# EAGLE schematic W1209_PIC (EAGLE 7.7.0)
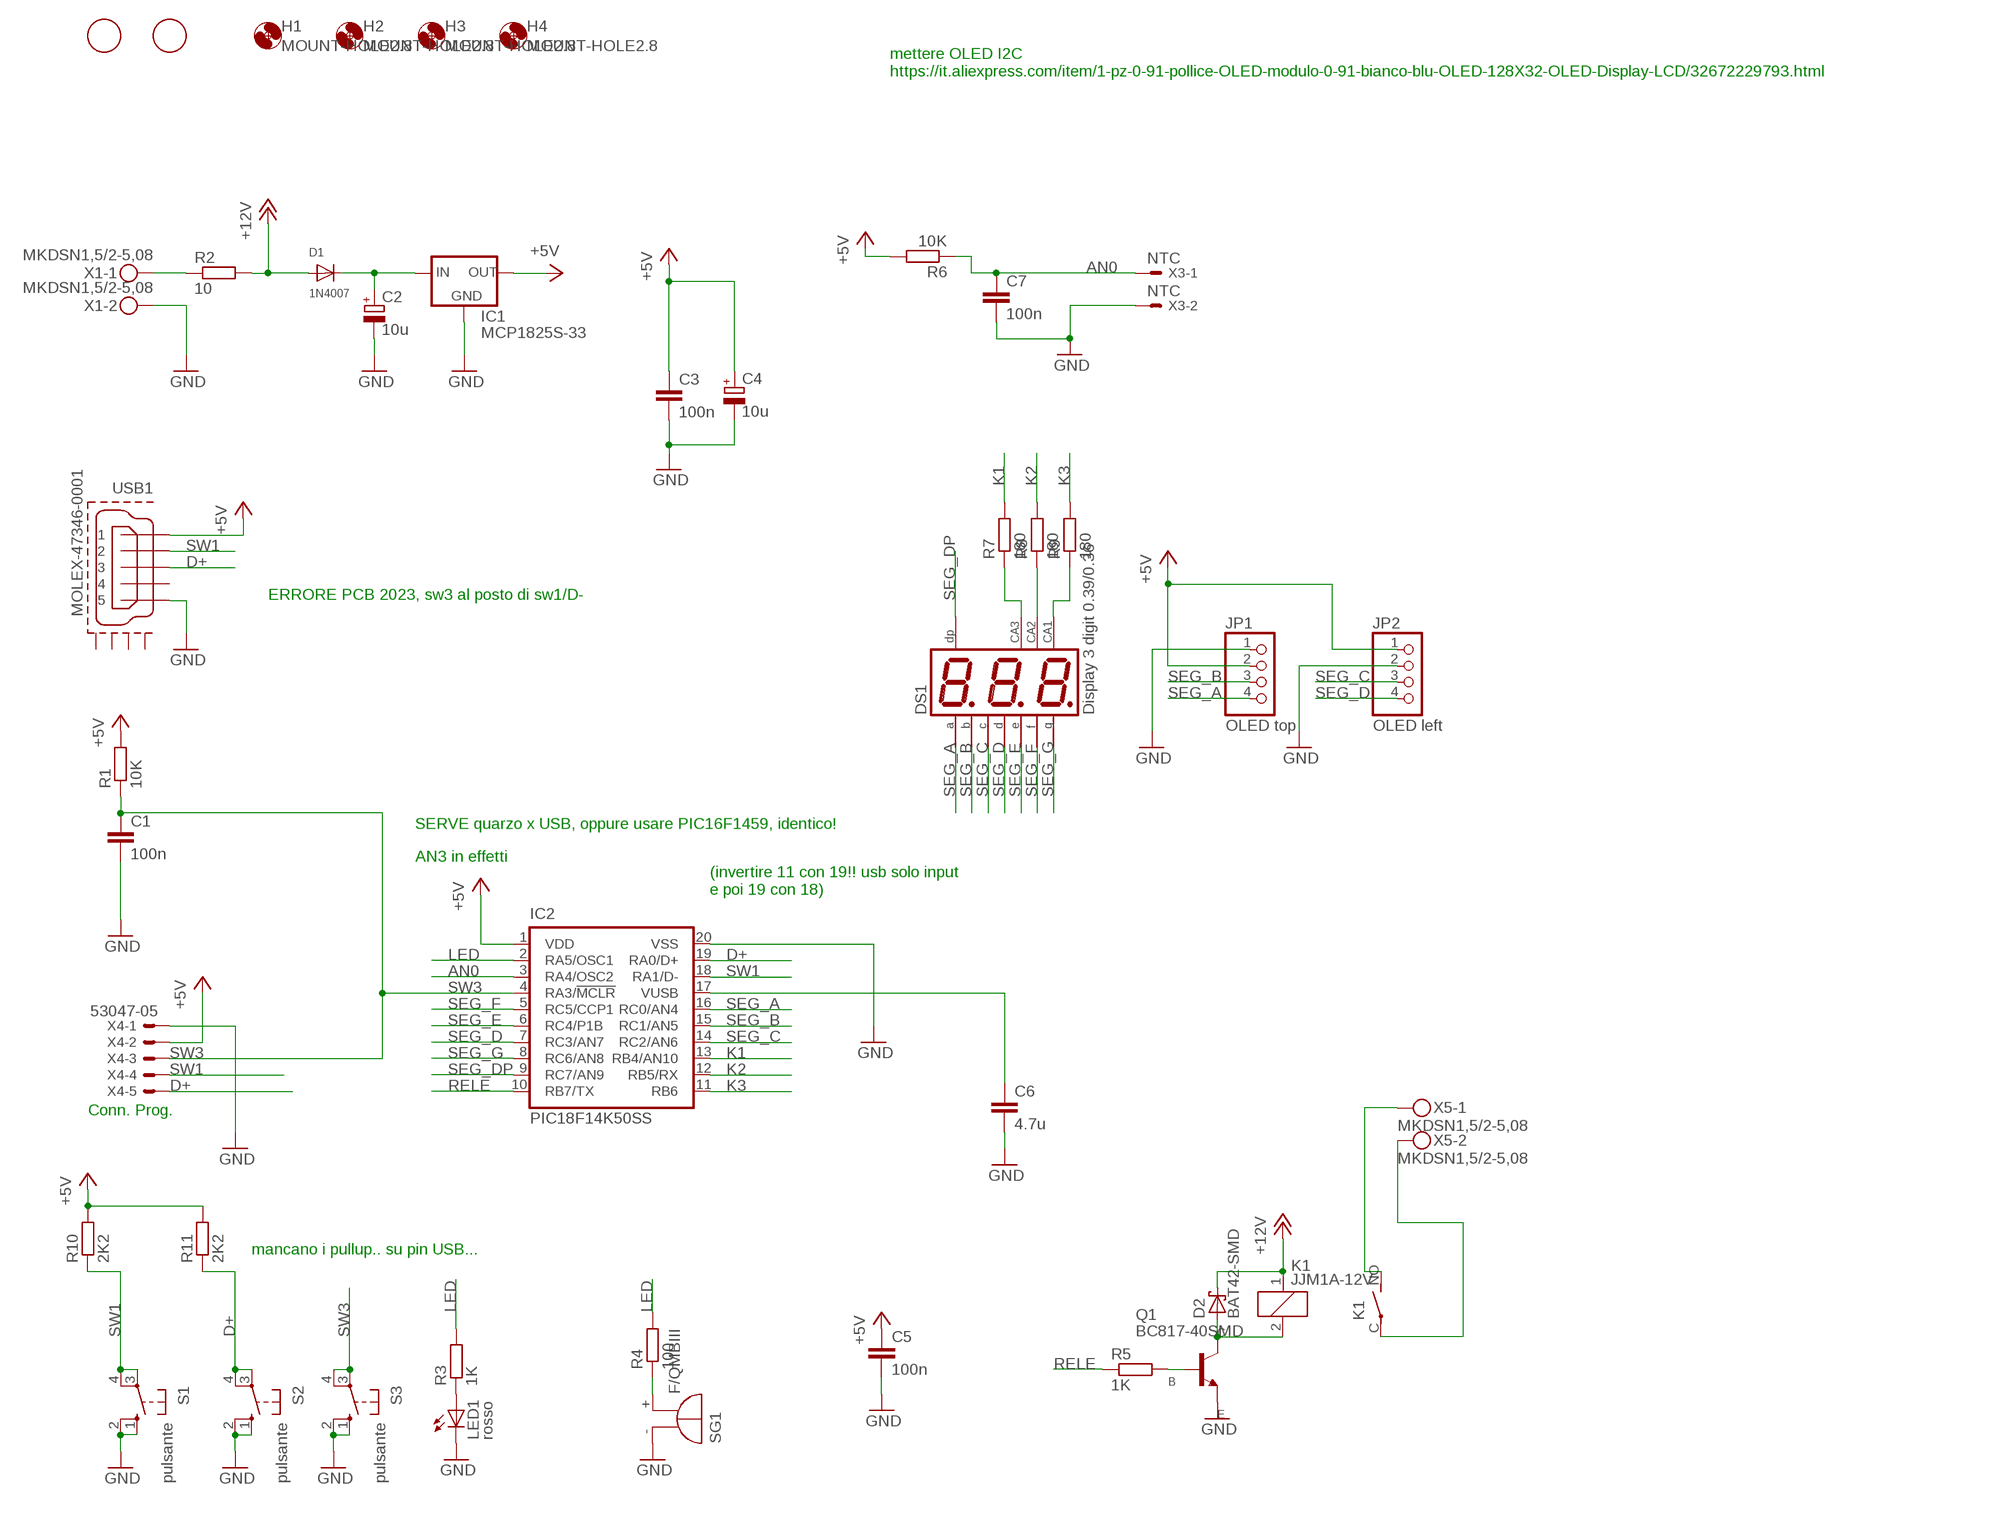
[diagram p0: schematic, sheet 1]

## Parts
C1  100n  C-EUC0805  [C0805]
C2  10u  CPOL-EUSMCC  [SMC_C]
C3  100n  C-EUC0805  [C0805]
C4  10u  CPOL-EUSMCB  [SMC_B]
C5  100n  C-EUC0805  [C0805]
C6  4.7u  C-EUC1206  [C1206]
C7  100n  C-EUC0805  [C0805]
D1  1N4007  DIODESMA  [SMADIODE]
D2  BAT42-SMD  [DO214AC]
DS1  Display 3 digit 0.39/0.36  KLT36XX  [KLT36XX]
F1  FIDUCIAL  [FIDUCIAL_1MM]
F2  FIDUCIAL  [FIDUCIAL_1MM]
H1  MOUNT-HOLE2.8  [2,8]
H2  MOUNT-HOLE2.8  [2,8]
H3  MOUNT-HOLE2.8  [2,8]
H4  MOUNT-HOLE2.8  [2,8]
IC1  MCP1825S-33  MCP1825SSOT223  [SOT223]
IC2  PIC18F14K50SS  [SS20]
JP1  OLED top  PINHD-1X4  [1X04]
JP2  OLED left  PINHD-1X4  [1X04]
K1  JJM1A-12V  [JJM1A]
LED1  rosso  LEDLD260  [LD260]
Q1  BC817-40SMD  [SOT23-BEC]
R1  10K  R-EU_R0805  [R0805]
R2  10  R-EU_R2512  [R2512]
R3  1K  R-EU_R0805  [R0805]
R4  100  R-EU_R0805  [R0805]
R5  1K  R-EU_R0805  [R0805]
R6  10K  R-EU_R0805  [R0805]
R7  180  R-EU_R0805  [R0805]
R8  180  R-EU_R0805  [R0805]
R9  180  R-EU_R0805  [R0805]
R10  2K2  R-EU_R0805  [R0805]
R11  2K2  R-EU_R0805  [R0805]
S1  pulsante  10-XX  [B3F-10XX]
S2  pulsante  10-XX  [B3F-10XX]
S3  pulsante  10-XX  [B3F-10XX]
SG1  F/QMBIII  [F/QMBIII]
USB1  MOLEX-47346-0001  [MOLEX-47364-0001]
X1  MKDSN1,5/2-5,08  [MKDSN1,5/2-5,08]
X3  NTC  KK-156-2  [KK-156-2]
X4  53047-05  [53047-05]
X5  MKDSN1,5/2-5,08  [MKDSN1,5/2-5,08]

## Nets
+5V [N3]: C3.1 C4.+ C5.1 IC1.3(OUT) IC2.1(VDD) JP1.2 JP2.1 R1.2 R6.2 R10.2 R11.2 USB1.1 X4.2
+12V [N3]: D1.A D2.C K1.1 R2.2
AN0: C7.1 IC2.3(RA4/OSC2) R6.1 X3.1
D+: IC2.19(RA0/D+) R11.1 S2.3(P) S2.4(P1) USB1.3 X4.5
GND [N3]: C1.2 C2.- C3.2 C4.- C5.2 C6.2 C7.2 IC1.2(GND) IC1.4(GND) IC2.20(VSS) JP1.1 JP2.2 LED1.K(C) Q1.E S1.1(S) S1.2(S1) S2.1(S) S2.2(S1) S3.1(S) S3.2(S1) SG1.-(+) USB1.5 X1.2 X3.2 X4.1
K1: IC2.13(RB4/AN10) R7.2
K2: IC2.12(RB5/RX) R8.2
K3: IC2.11(RB6) R9.2
LED: IC2.2(RA5/OSC1) R3.2 R4.2
N$1 [N3]: C2.+ D1.C IC1.1(IN)
N$2: D2.A K1.2 Q1.C
N$3 [N2]: K1.C(2:P) X5.2
N$4 [N2]: K1.NO(2:S) X5.1
N$5: R4.1 SG1.+(-)
N$6 [N3]: R2.1 X1.1
N$7: DS1.P$12(CA) R7.1
N$8: DS1.P$8(CA) R9.1
N$9: DS1.P$9(CA) R8.1
N$11: Q1.B R5.2
N$14: LED1.A R3.1
N$15: C6.1 IC2.17(VUSB)
RELE: IC2.10(RB7/TX) R5.1
SEG_A: DS1.P$11(A) IC2.16(RC0/AN4) JP1.4
SEG_B: DS1.P$7(B) IC2.15(RC1/AN5) JP1.3
SEG_C: DS1.P$4(C) IC2.14(RC2/AN6) JP2.3
SEG_D: DS1.P$2(D) IC2.7(RC3/AN7) JP2.4
SEG_DP: DS1.P$3(DP) IC2.9(RC7/AN9)
SEG_E: DS1.P$1(E) IC2.6(RC4/P1B)
SEG_F: DS1.P$10(F) IC2.5(RC5/CCP1)
SEG_G: DS1.P$5(G) IC2.8(RC6/AN8)
SW1: IC2.18(RA1/D-) R10.1 S1.3(P) S1.4(P1) USB1.2 X4.4
SW3: C1.1 IC2.4(RA3/!MCLR!) R1.1 S3.3(P) S3.4(P1) X4.3
Unconnected: USB1.4 USB1.GND1 USB1.GND2 USB1.GND3 USB1.GND4

## Notes on the sheet
- mettere OLED I2C
  https://it.aliexpress.com/item/1-pz-0-91-pollice-OLED-modulo-0-91-bianco-blu-OLED-128X32-OLED-Display-LCD/32672229793.html
- ERRORE PCB 2023, sw3 al posto di sw1/D-
- SERVE quarzo x USB, oppure usare PIC16F1459, identico!
- AN3 in effetti
- (invertire 11 con 19!! usb solo input
  e poi 19 con 18)
- Conn. Prog.
- mancano i pullup.. su pin USB...

## Library data of the parts
C1 C3 C5-C7 = resistor:C-EU: CAPACITOR, European symbol
C2 C4 = resistor:CPOL-EU: POLARIZED CAPACITOR, European symbol
D1 = adafruit:DIODE: Diode SMADIODE - SMA Surface Mount Package 20V 1A Schottky Diode Digikey: 641-1014-6-ND DO-1N4148 - Through Hole Small Current Diode SOD-123 20V 1 A (.5mV Vf) Schottky Diode - Digikey: MBRX120TPMSCT-ND SOD-323 10V 570mA (.38mV Vf, 3ns) Schottky Diode - Digikey: ZLLS410CT-ND SOD-523 30V 30mA Schottky Diode (RB751S-40TE61) - Digikey: RB751S-40TE61CT-ND SOT23-R/W - SOT23 Package (R = Solder Paste/Reflow Ovens, W = Hand-Soldering) BAT54Film 40V 300mA - Digikey: 497-7162-1-ND
D2 = diode:BAT42-SMD: DIODE barrier diode
DS1 = kingbright:KLT36XX: KLT36XX 0.39" 3 digit
F1 F2 = adafruit:FIDUCIAL: For use by pick and place machines to calibrate the vision/machine, 1mm By microbuilder.eu
H1-H4 = holes:MOUNT-HOLE: MOUNTING HOLE with drill center marker
IC1 = microchip2:MCP1825S: VOLTAGE REGULATOR
IC2 = microchip2:PIC18F14K50: PIC18F14K50
JP1 JP2 = pinhead:PINHD-1X4: PIN HEADER
K1 = relay:JJM1A-12V: HALF-SIZE AUTOMOTIVE RELAY NAiS Source: http://www.mew-europe.com/.. en_ds_61210_0001.pdf; OC_FARNELL: unknown; OC_NEWARK: unknown
LED1 = led:LED: LED OSRAM: - CHIPLED LG R971, LG N971, LY N971, LG Q971, LY Q971, LO R971, LY R971 LH N974, LH R974 LS Q976, LO Q976, LY Q976 LO Q996 - Hyper CHIPLED LW Q18S LB Q993, LB Q99A, LB R99A - SideLED LS A670, LO A670, LY A670, LG A670, LP A670 LB A673, LV A673, LT A673, LW A673 LH A674 LY A675 LS A676, LA A676, LO A676, LY A676, LW A676 LS A679, LY A679, LG A679 - Hyper Micro SIDELED® LS Y876, LA Y876, LO Y876, LY Y876 LT Y87S - SmartLED LW L88C, LW L88S LB L89C, LB L89S, LG L890 LS L89K, LO L89K, LY L89K LS L896, LA L896, LO L896, LY L896 - TOPLED LS T670, LO T670, LY T670, LG T670, LP T670 LSG T670, LSP T670, LSY T670, LOP T670, LYG T670 LG T671, LOG T671, LSG T671 LB T673, LV T673, LT T673, LW T673 LH T674 LS T676, LA T676, LO T676, LY T676, LB T676, LH T676, LSB T676, LW T676 LB T67C, LV T67C, LT T67C, LS T67K, LO T67K, LY T67K, LW E67C LS E67B, LA E67B, LO E67B, LY E67B, LB E67C, LV E67C, LT E67C LW T67C LS T679, LY T679, LG T679 LS T770, LO T770, LY T770, LG T770, LP T770 LB T773, LV T773, LT T773, LW T773 LH T774 LS E675, LA E675, LY E675, LS T675 LS T776, LA T776, LO T776, LY T776, LB T776 LHGB T686 LT T68C, LB T68C - Hyper Mini TOPLED® LB M676 - Mini TOPLED Santana® LG M470 LS M47K, LO M47K, LY M47K Source: http://www.osram.convergy.de LUXEON: - LUMILED® LXK2-PW12-R00, LXK2-PW12-S00, LXK2-PW14-U00, LXK2-PW14-V00 LXK2-PM12-R00, LXK2-PM12-S00, LXK2-PM14-U00 LXK2-PE12-Q00, LXK2-PE12-R00, LXK2-PE12-S00, LXK2-PE14-T00, LXK2-PE14-U00 LXK2-PB12-K00, LXK2-PB12-L00, LXK2-PB12-M00, LXK2-PB14-N00, LXK2-PB14-P00, LXK2-PB14-Q00 LXK2-PR12-L00, LXK2-PR12-M00, LXK2-PR14-Q00, LXK2-PR14-R00 LXK2-PD12-Q00, LXK2-PD12-R00, LXK2-PD12-S00 LXK2-PH12-R00, LXK2-PH12-S00 LXK2-PL12-P00, LXK2-PL12-Q00, LXK2-PL12-R00 Source: www.luxeon.com KINGBRIGHT: KA-3528ASYC Source: www.kingbright.com
Q1 = transistor-npn:BC817*: NPN Transistor
R1-R11 = resistor:R-EU_: RESISTOR, European symbol
S1-S3 = switch-omron:10-XX: OMRON SWITCH; MPN: B3F-1000; OC_FARNELL: 176432; OC_NEWARK: 36M3542
SG1 = buzzer:F/QMBIII: BUZZER Source: Buerklin; OC_FARNELL: unknown; OC_NEWARK: unknown
USB1 = usb_con-update:MOLEX-47346-0001: MICRO USB B, BOTTOM MOUNT
X1 X5 = con-phoenix-508:MKDSN1,5/2-5,08: MKDSN 1,5/ 2-5,08 Printklemme Nennstrom: 13,5 A Nennspannung: 250 V Rastermaß: 5,08 mm Polzahl: 2 Anschlussart: Schraubanschluss Montage: Löten Anschlussrichtung Leiter/Platine: 0 ° Artikelnummer: 1729128 Source: http://eshop.phoenixcontact.com .. 1729128.pdf
X3 = con-molex:KK-156-2: KK 156 HEADER Source: http://www.molex.com/pdm_docs/sd/026604100_sd.pdf; OC_FARNELL: unknown; OC_NEWARK: unknown
X4 = con-molex:53?-05: CONNECTOR wire to board 1.25 mm (.049 inch) pitch header; MF: MOLEX; MPN: 53047-0510; OC_FARNELL: 9732861; OC_NEWARK: 38C9901

## Net classes
1 N1: width 1.016 mm, clearance 0.762 mm
2 N2: width 0.762 mm, clearance 0.762 mm
3 N3: width 0.406 mm
4 GND: width 0.406 mm, clearance 0.152 mm